# EAGLE design Me-Base Shield v2.0 (EAGLE 6.2)
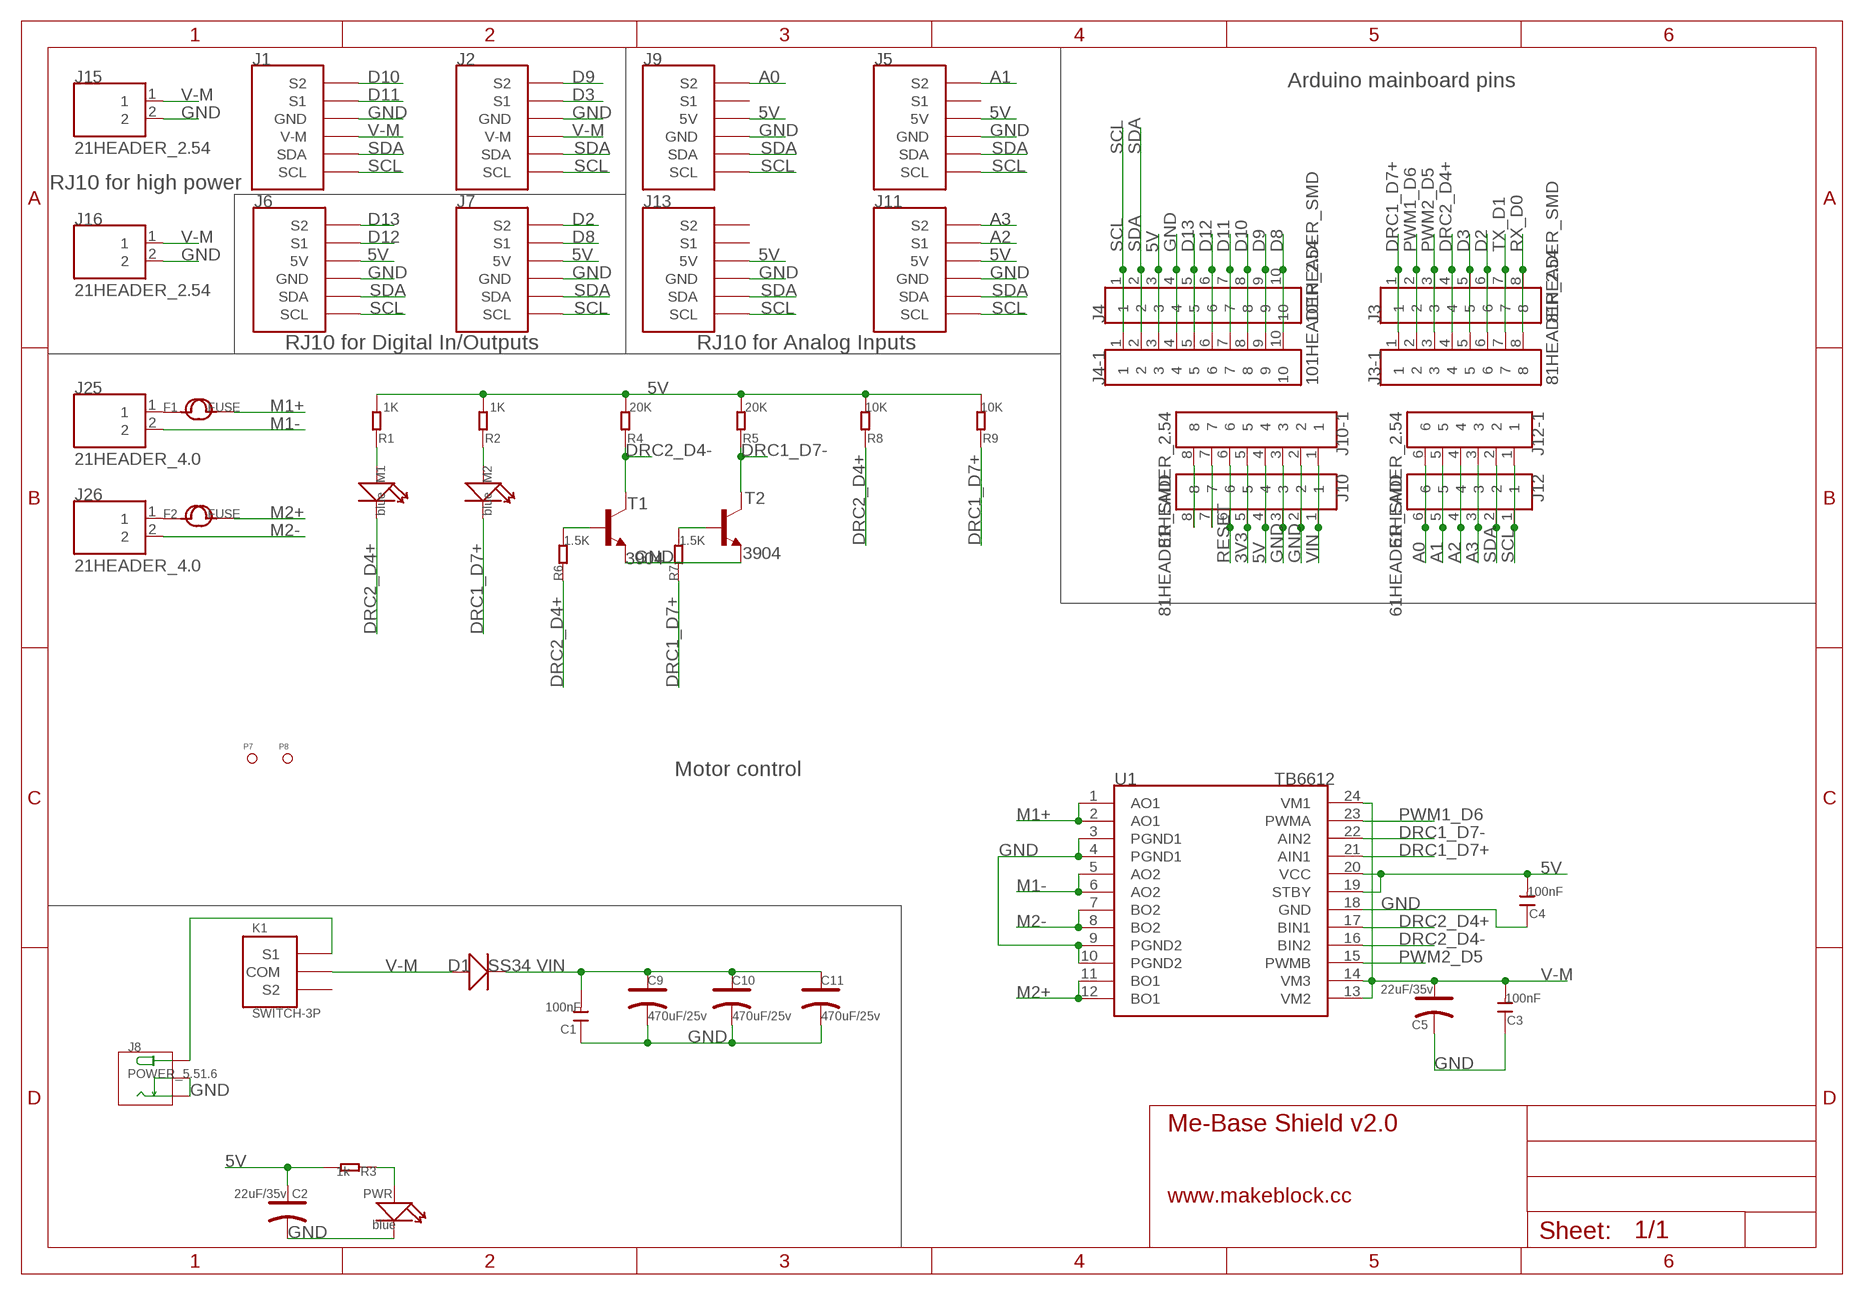
[diagram p0: schematic, sheet 1]

## Parts
C1  100nF  C-0603  [0603]
C2  22uF/35v  CAP-ELECTRO-B  [ELECTRO-SMD-B-4.8MM]
C3  100nF  C-0603  [0603]
C4  100nF  C-0603  [0603]
C5  22uF/35v  CAP-ELECTRO-B  [ELECTRO-SMD-B-4.8MM]
C9  470uF/25v  CAP-ELECTRO-E  [ELECTRO-SMD-E-7.8MM]
C10  470uF/25v  CAP-ELECTRO-E  [ELECTRO-SMD-E-7.8MM]
C11  470uF/25v  CAP-ELECTRO-E  [ELECTRO-SMD-E-7.8MM]
D1  SS34  D'SMA'  [D2010]
F1  FUSE  [FUSE]
F2  FUSE  [FUSE]
J1  RJ11-6P6C-MOTOR  [RJ11-6P6C]
J2  RJ11-6P6C-MOTOR  [RJ11-6P6C]
J3  81HEADER_SMD  [8*1HEADER_SMD]
J3-1  81HEADER_2.54  [8*1HEADER_2.54]
J4  101HEADER_SMD  [10*1HEADER_SMD]
J4-1  101HEADER_2.54  [10*1HEADER_2.54]
J5  RJ11-6P6C-DIGI  [RJ11-6P6C]
J6  RJ11-6P6C-DIGI  [RJ11-6P6C]
J7  RJ11-6P6C-DIGI  [RJ11-6P6C]
J8  POWER_5.51.6  [POWER_5.5*1.6]
J9  RJ11-6P6C-DIGI  [RJ11-6P6C]
J10  81HEADER_SMD  [8*1HEADER_SMD]
J10-1  81HEADER_2.54  [8*1HEADER_2.54]
J11  RJ11-6P6C-DIGI  [RJ11-6P6C]
J12  61HEADER_SMD  [6*1HEADER_SMD]
J12-1  61HEADER_2.54  [6*1HEADER_2.54]
J13  RJ11-6P6C-DIGI  [RJ11-6P6C]
J15  21HEADER_2.54  [2*1HEADER_2.54]
J16  21HEADER_2.54  [2*1HEADER_2.54]
J25  21HEADER_4.0  [2*1HEADER_4.0]
J26  21HEADER_4.0  [2*1HEADER_4.0]
K1  SWITCH-3P  [SWITCH_3P]
M1  blue  LED'0603'  [LED-0603]
M2  blue  LED'0603'  [LED-0603]
P7  PAD-MARK  [ROUND-MARK-1.0]
P8  PAD-MARK  [ROUND-MARK-1.0]
PWR  blue  LED'0603'  [LED-0603]
R1  1K  R-0603  [0603]
R2  1K  R-0603  [0603]
R3  1k  R-0603  [0603]
R4  20K  R-0603  [0603]
R5  20K  R-0603  [0603]
R6  1.5K  R-0603  [0603]
R7  1.5K  R-0603  [0603]
R8  10K  R-0603  [0603]
R9  10K  R-0603  [0603]
T1  3904  [3904]
T2  3904  [3904]
U1  TB6612  [TB6612FNG]

## Nets
3V3: J10-1.5 J10.5
5V: C2.+ C4.2 J4-1.3 J4.3 J5.4(5V) J6.4(5V) J7.4(5V) J9.4(5V) J10-1.4 J10.4 J11.4(5V) J13.4(5V) R1.2 R2.2 R3.2 R4.2 R5.2 R8.2 R9.2 U1.19(STBY) U1.20(VCC)
A0: J9.6(S2) J12-1.6 J12.6
A1: J5.6(S2) J12-1.5 J12.5
A2: J11.5(S1) J12-1.4 J12.4
A3: J11.6(S2) J12-1.3 J12.3
D2: J3-1.6 J3.6 J7.6(S2)
D3: J2.5(S1) J3-1.5 J3.5
D8: J4-1.10 J4.10 J7.5(S1)
D9: J2.6(S2) J4-1.9 J4.9
D10: J1.6(S2) J4-1.8 J4.8
D11: J1.5(S1) J4-1.7 J4.7
D12: J4-1.6 J4.6 J6.5(S1)
D13: J4-1.5 J4.5 J6.6(S2)
DRC1_D7+: J3-1.1 J3.1 M2.- R7.1 R9.1 U1.21(AIN1)
DRC1_D7-: R5.1 T2.3(C) U1.22(AIN2)
DRC2_D4+: J3-1.4 J3.4 M1.- R6.1 R8.1 U1.17(BIN1)
DRC2_D4-: R4.1 T1.3(C) U1.16(BIN2)
GND: C1.1 C2.- C3.1 C4.1 C5.- C9.- C10.- C11.- J1.4(GND) J2.4(GND) J4-1.4 J4.4 J5.3(GND) J6.3(GND) J7.3(GND) J8.1(-) J8.2(-) J8.3(-) J8.4(-) J8.5(-) J8.6(-) J8.7(-) J8.8(-) J8.9(-) J8.10(-) J8.11(-) J8.12(-) J8.13(CDN) J8.14(CDN) J8.15(CDN) J8.16(CDN) J8.17(CDN) J8.18(CDN) J8.19(CDN) J8.20(CDN) J8.21(CDN) J8.22(CDN) J8.23(CDN) J8.24(CDN) J8.- J8.CDN J9.3(GND) J10-1.2 J10-1.3 J10.2 J10.3 J11.3(GND) J13.3(GND) J15.2 J16.2 PWR.- T1.2(E) T2.2(E) U1.3(PGND1) U1.4(PGND1) U1.9(PGND2) U1.10(PGND2) U1.18(GND)
M1+: F1.2 U1.1(AO1) U1.2(AO1)
M1-: J25.2 U1.5(AO2) U1.6(AO2)
M2+: F2.2 U1.11(BO1) U1.12(BO1)
M2-: J26.2 U1.7(BO2) U1.8(BO2)
N$1: J10-1.7 J10.7
N$2: J10-1.8 J10.8
N$3: M1.+ R1.1
N$4: M2.+ R2.1
N$5: PWR.+ R3.1
N$6: F1.1 J25.1
N$7: J8.25(+) J8.26(+) J8.27(+) J8.28(+) J8.29(+) J8.30(+) J8.31(+) J8.32(+) J8.33(+) J8.34(+) J8.35(+) J8.36(+) J8.+ K1.1(S1) K1.P$6(S1) K1.P$16(S1) K1.P$17(S1) K1.P$18(S1) K1.P$20(S1) K1.P$21(S1)
N$8: F2.1 J26.1
N$22: R6.2 T1.1(B)
N$23: R7.2 T2.1(B)
PWM1_D6: J3-1.2 J3.2 U1.23(PWMA)
PWM2_D5: J3-1.3 J3.3 U1.15(PWMB)
RESET: J10-1.6 J10.6
RX_D0: J3-1.8 J3.8
SCL: J1.1(SCL) J2.1(SCL) J4-1.1 J4.1 J5.1(SCL) J6.1(SCL) J7.1(SCL) J9.1(SCL) J11.1(SCL) J12-1.1 J12.1 J13.1(SCL)
SDA: J1.2(SDA) J2.2(SDA) J4-1.2 J4.2 J5.2(SDA) J6.2(SDA) J7.2(SDA) J9.2(SDA) J11.2(SDA) J12-1.2 J12.2 J13.2(SDA)
TX_D1: J3-1.7 J3.7
V-M: C3.2 C5.+ D1.+ J1.3(V-M) J2.3(V-M) J15.1 J16.1 K1.2(COM) K1.P$1(COM) K1.P$2(COM) K1.P$3(COM) K1.P$4(COM) K1.P$5(COM) K1.P$7(COM) U1.13(VM2) U1.14(VM3) U1.24(VM1)
VIN: C1.2 C9.+ C10.+ C11.+ D1.- J10-1.1 J10.1
Unconnected: J5.5(S1) J9.5(S1) J13.5(S1) J13.6(S2) K1.3(S2) K1.P$8(S2) K1.P$9(S2) K1.P$11(S2) K1.P$12(S2) K1.P$13(S2) K1.P$14(S2)

## Notes on the sheet
- Arduino mainboard pins
- RJ10 for high power
- RJ10 for Digital In/Outputs | RJ10 for Analog Inputs
- Motor control
- www.makeblock.cc

## Library data of the parts
C1 C3 C4 = Discrete:C*: Ceramic Capacitors
C2 C5 C9-C11 = Discrete:CAP*: Electrolytic Capacitors,Tantalum Capacitors and Super Capacitors
D1 = Discrete:D*
F1 F2 = Makeblock:FUSE
J1 J2 = Makeblock:RJ11-6P6C-MOTOR
J3 J10 = Me-Base Shield:8*1HEADER_SMD: 8x1HEADER_SMD
J3-1 J10-1 = Me-Base Shield:8*1HEADER_2.54: 8x1HEADER_2.54
J4 = Me-Base Shield:10*1HEADER_SMD: 10x1HEADER_SMD
J4-1 = Me-Base Shield:10*1HEADER_2.54: 10x1HEADER_2.54
J5-J7 J9 J11 J13 = Makeblock:RJ11-6P6C-DIGI
J8 = Makeblock:POWER_5.5*1.6
J12 = Me-Base Shield:6*1HEADER_SMD: 6x1HEADER_SMD
J12-1 = Me-Base Shield:6*1HEADER_2.54: 6x1HEADER_2.54
J15 J16 = Me-Base Shield:2*1HEADER_2.54
J25 J26 = Makeblock:2*1HEADER_4.0
K1 = Makeblock:SWITCH-3P
M1 M2 PWR = Discrete:LED*
P7 P8 = Discrete:PAD-MARK; PARTNO: DNP
R1-R9 = Discrete:R*
T1 T2 = Makeblock:3904
U1 = Me-Base Shield:TB6612: TB6612

## Board
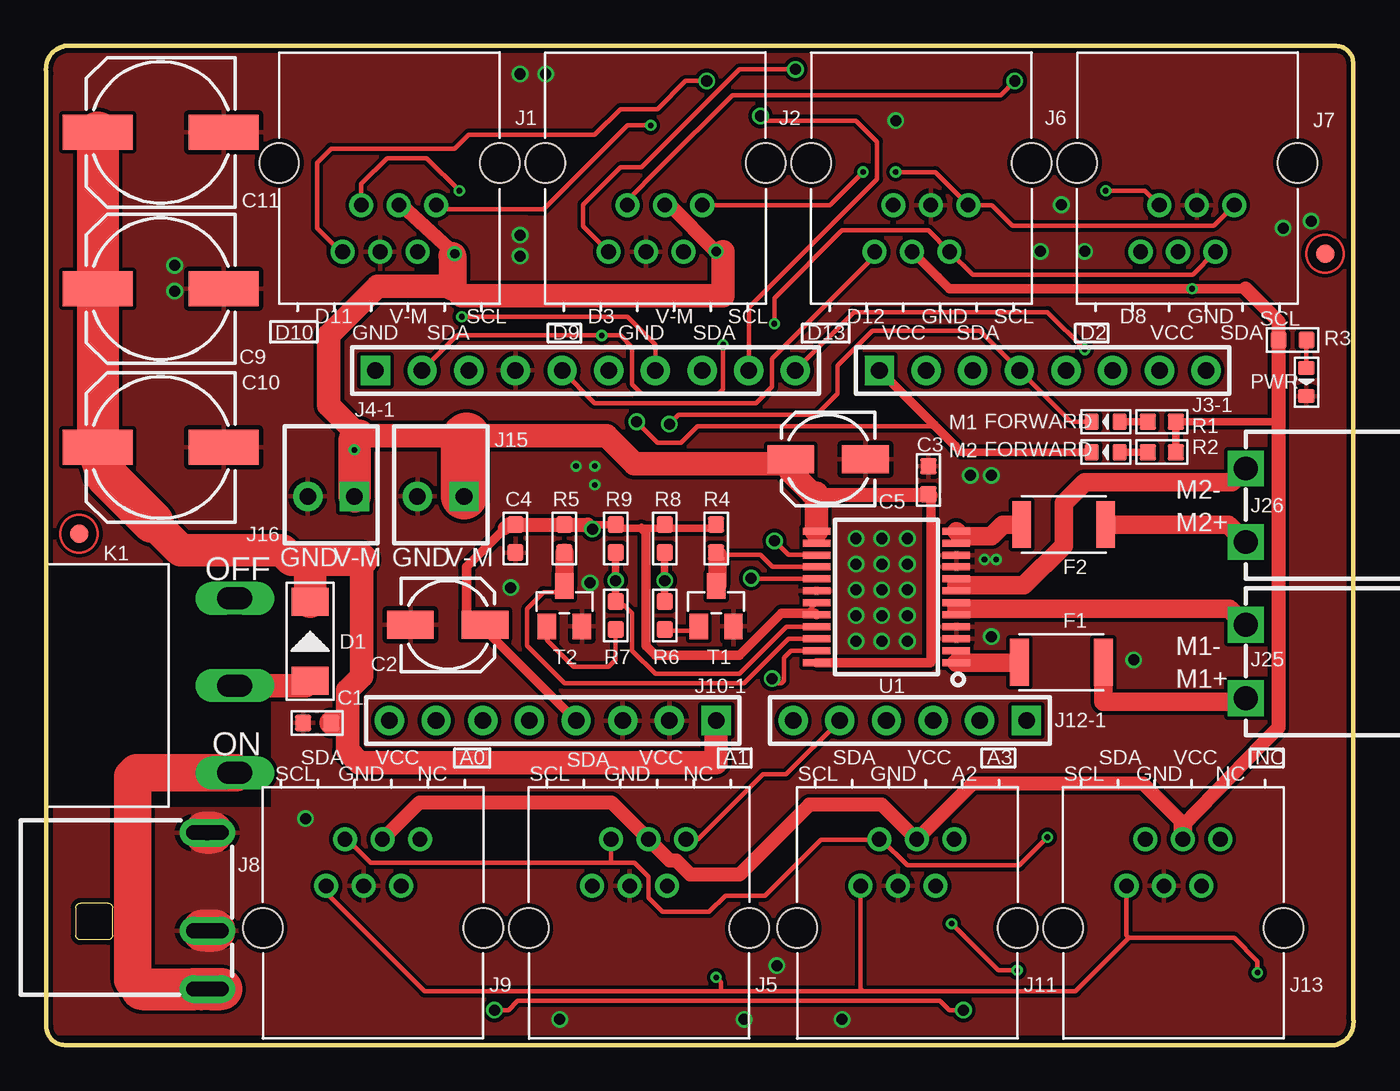
[diagram p1: board, top side]
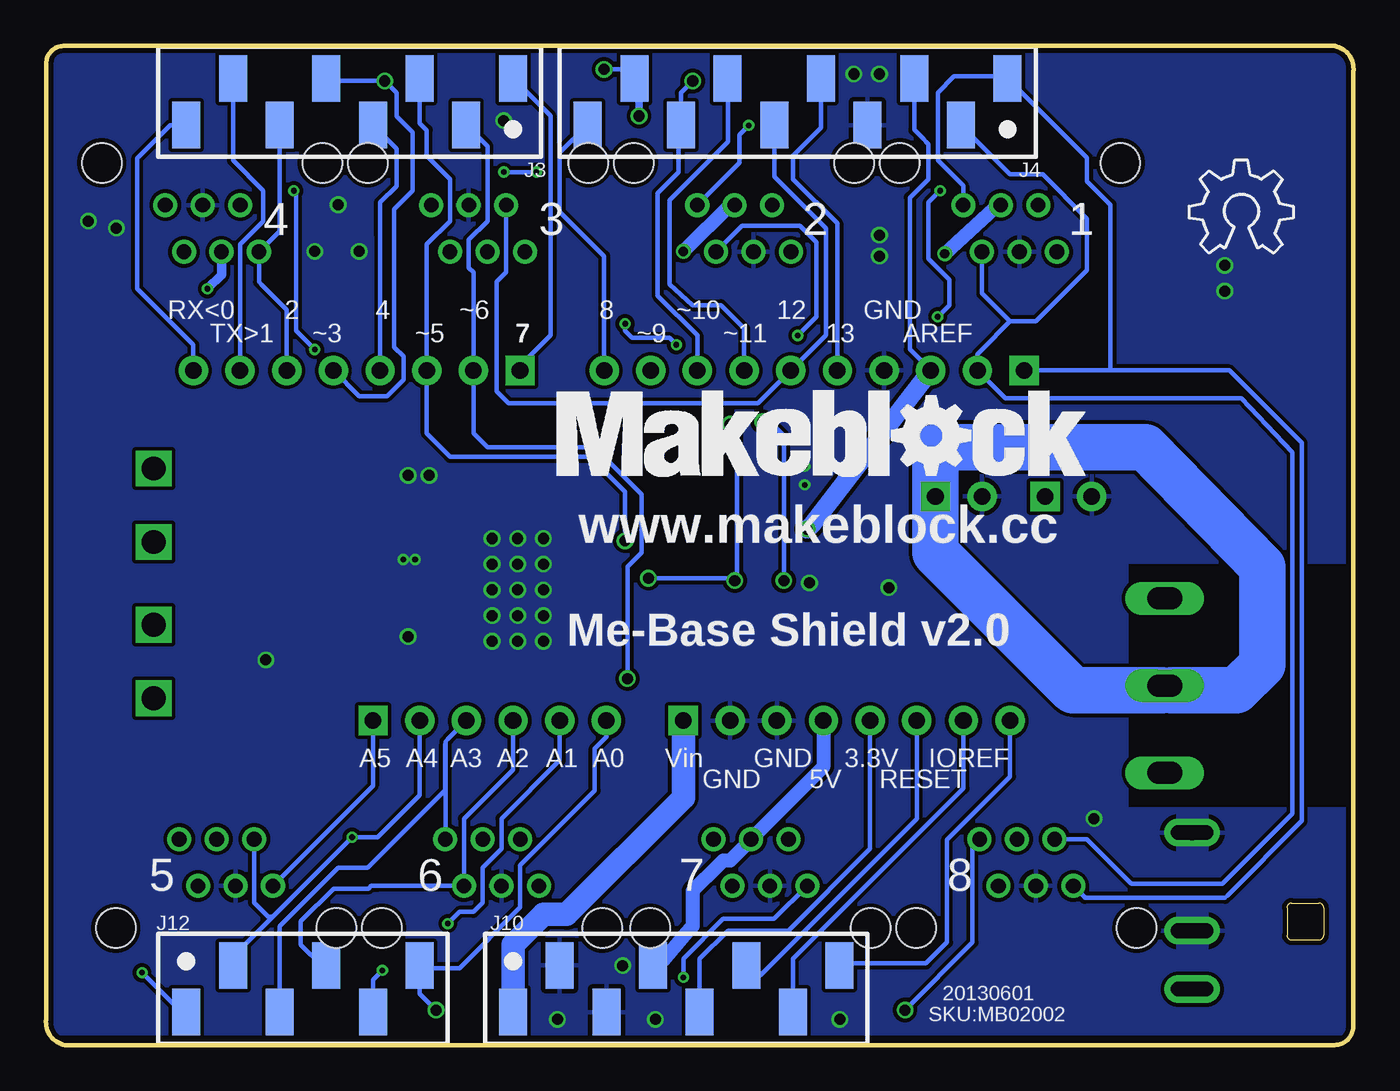
[diagram p2: board, bottom side, seen from below]

Size 71.17 x 54.36 mm. Coordinates in mm from the lower left corner, seen from the top.
Outline: 71.15,1.52 71.15,53.48 arc90 70.15,54.36
Outline: 70.13,54.36 1.03,54.36 arc90 0.03,52.85 0.03,1 arc90 1.03,0 70.15,0 arc90 71.15,1.51
Copper layers (1*16): Top 0.035mm / dielectric 1.5mm / Bottom 0.035mm
Design rules: minimum track width 6mil, minimum drill 12mil, track to track 8mil, track to pad 8mil, pad to pad 8mil, via to via 8mil, smd to smd 0mil, copper to edge 10mil, drill to drill 10mil, minimum pad ring 10mil, minimum via ring 6mil, stop-mask expansion 2mil, vias tented up to drill 100mil, thermal gap 10mil

### Footprints (pad centres in the part's own frame; a part is rotated, then mirrored left to right if it is on the bottom)
0603 = smd 0.889 x 0.889: 1 -0.762,0; 2 0.762,0
ELECTRO-SMD-B-4.8MM = smd 2.54 x 1.524: + 2.032,0; - -2.032,0
ELECTRO-SMD-E-7.8MM = smd 3.81 x 1.905: + 3.429,0; - -3.429,0
D2010 = smd 1.524 x 2.032: + -2.159,0; - 2.159,0
FUSE = smd 1.016 x 2.54: 1 -2.286,0; 2 2.286,0
RJ11-6P6C = drill 0.8: 1 -2.55,1.8; 2 -1.53,4.34; 3 -0.51,1.8; 4 0.51,4.34; 5 1.53,1.8; 6 2.55,4.34 | hole 2.15: -6,-0.5; 6,-0.5
8*1HEADER_SMD = smd 2.54 x 1.524: 1 0,0; 2 2.54,-2.54; 3 0,-5.08; 4 2.54,-7.62; 5 0,-10.16; 6 2.54,-12.7; 7 0,-15.24; 8 2.54,-17.78
8*1HEADER_2.54 = drill 0.9 pad 1.6 square: 1 0,0 | drill 0.9 pad 1.6: 2 0,-2.54; 3 0,-5.08; 4 0,-7.62; 5 0,-10.16; 6 0,-12.7; 7 0,-15.24; 8 0,-17.78
10*1HEADER_SMD = smd 2.54 x 1.524: 1 0,0; 2 2.54,-2.54; 3 0,-5.08; 4 2.54,-7.62; 5 0,-10.16; 6 2.54,-12.7; 7 0,-15.24; 8 2.54,-17.78; 9 0,-20.32; 10 2.54,-22.86
10*1HEADER_2.54 = drill 0.9 pad 1.6 square: 1 0,0 | drill 0.9 pad 1.6: 2 0,-2.54; 3 0,-5.08; 4 0,-7.62; 5 0,-10.16; 6 0,-12.7; 7 0,-15.24; 8 0,-17.78; 9 0,-20.32; 10 0,-22.86
POWER_5.5*1.6 = drill 0.8: 1 -5.334,9.398; 2 -5.334,9.525; 3 -5.334,9.652; 4 -5.334,9.779; 5 -5.334,9.906; 6 -5.334,10.033; 7 -5.334,10.287; 8 -5.334,10.414; 9 -5.334,10.541; 10 -5.334,10.668; 11 -5.334,10.795; 12 -5.334,10.922; 13 0,9.398; 14 0,9.525; 15 0,9.652; 16 0,9.779; 17 0,9.906; 18 0,10.033; 19 0,10.287; 20 0,10.414; 21 0,10.541; 22 0,10.668; 23 0,10.795; 24 0,10.922; 25 3.175,9.398; 26 3.175,9.525; 27 3.175,9.652; 28 3.175,9.779; 29 3.175,9.906; 30 3.175,10.033; 31 3.175,10.287; 32 3.175,10.414; 33 3.175,10.541; 34 3.175,10.668; 35 3.175,10.795; 36 3.175,10.922 | drill 0.813 pad 1.524 long: + 3.175,10.16; - -5.334,10.16; CDN 0,10.16
6*1HEADER_SMD = smd 2.54 x 1.524: 1 0,0; 2 2.54,-2.54; 3 0,-5.08; 4 2.54,-7.62; 5 0,-10.16; 6 2.54,-12.7
6*1HEADER_2.54 = drill 0.9 pad 1.6 square: 1 0,0 | drill 0.9 pad 1.6: 2 0,-2.54; 3 0,-5.08; 4 0,-7.62; 5 0,-10.16; 6 0,-12.7
2*1HEADER_2.54 = drill 0.9 pad 1.6 square: 1 0,-2.54 | drill 0.9 pad 1.6: 2 0,0
2*1HEADER_4.0 = drill 1.3 pad 1.95 square: 1 0,-4; 2 0,0
SWITCH_3P = drill 1.2 long: 1 -4.75,-4.26; 2 0,-4.16; 3 4.75,-4.46; P$1 0,-4.76; P$2 0,-4.56; P$3 0,-4.46; P$4 0,-4.36; P$5 0,-4.26; P$6 -4.75,-4.76; P$7 0,-4.06; P$8 4.75,-4.76; P$9 4.75,-4.56; P$11 4.75,-4.36; P$12 4.75,-4.26; P$13 4.75,-4.16; P$14 4.75,-4.06; P$16 -4.75,-4.56; P$17 -4.75,-4.46; P$18 -4.75,-4.36; P$20 -4.75,-4.16; P$21 -4.75,-4.06
LED-0603 = smd 0.762 x 0.889: + -0.762,0; - 0.762,0
ROUND-MARK-1.0 = smd 1.016 x 1.016: P$1 0,0
3904 = smd 1 x 1.4: 1 -0.95,-1.1; 2 0.95,-1.1; 3 0,1.1
TB6612FNG = smd 1.5 x 0.381: 1 -3.8,3.575; 2 -3.8,2.925; 3 -3.8,2.275; 4 -3.8,1.625; 5 -3.8,0.975; 6 -3.8,0.325; 7 -3.8,-0.325; 8 -3.8,-0.975; 9 -3.8,-1.625; 10 -3.8,-2.275; 11 -3.8,-2.925; 12 -3.8,-3.575; 13 3.8,-3.575; 14 3.8,-2.925; 15 3.8,-2.275; 16 3.8,-1.625; 17 3.8,-0.975; 18 3.8,-0.325; 19 3.8,0.325; 20 3.8,0.975; 21 3.8,1.625; 22 3.8,2.275; 23 3.8,2.925; 24 3.8,3.575

### Placement (x,y rotation side)
C1  14.76,17.53 0 top
C2  21.87,22.86 0 top
C3  48.03,30.73 270 top
C4  25.55,27.56 90 top
C5  42.57,31.88 180 top
C9  6.25,41.15 180 top
C10  6.25,32.51 180 top
C11  6.25,49.66 180 top
D1  14.38,21.97 90 top
F1  55.27,20.83 180 top
F2  55.4,28.32 180 top
J1  18.69,47.5 180 top
J2  33.17,47.5 180 top
J3  45.75,52.59 270 bottom
J3-1  45.36,36.7 90 top
J4  18.83,52.59 270 bottom
J4-1  17.93,36.7 90 top
J5  32.28,6.86 0 top
J6  47.65,47.5 180 top
J7  62.13,47.5 180 top
J8  -1.37,6.22 270 top
J9  17.81,6.86 0 top
J10  45.75,1.79 90 bottom
J10-1  36.47,17.65 270 top
J11  46.89,6.86 0 top
J12  63.53,1.79 90 bottom
J12-1  53.37,17.65 270 top
J13  61.37,6.86 0 top
J15  20.22,29.84 90 top
J16  14.25,29.84 90 top
J25  65.3,22.86 0 top
J26  65.3,31.37 0 top
K1  5.87,19.56 90 top
M1  57.68,33.91 180 top
M2  57.68,32.26 180 top
P7  1.8,27.81 0 top
P8  69.62,43.05 0 top
PWR  68.61,36.07 270 top
R1  60.73,33.91 0 top
R2  60.73,32.26 0 top
R3  67.84,38.35 180 top
R4  36.47,27.56 90 top
R5  28.22,27.56 90 top
R6  33.68,23.37 270 top
R7  31.01,23.37 270 top
R8  33.68,27.56 90 top
R9  31.01,27.56 90 top
T1  36.47,23.88 0 top
T2  28.22,23.88 0 top
U1  45.75,24.38 180 top
U$2  [OSHW_6X200_NOTEXT]  8.95,43.08 0 bottom

### Tracks (layer width: path | path; a pad name or v marks a point on that pad's centre or on a via)
3V3
  Bottom 0.254: J10-1.5 26.31,10.67 30.76,6.22 34.06,6.22 35.59,4.69 J10.5
  Bottom 0.406: J10.5
5V  (via drill 0.3 pad 0.61, 0.6)
  Top 0.254: 41.38,23.5 U1.19 | 23.96,22.48 23.96,22.54 | C2.+ 23.9,22.61 | 66.2,16.38 66.19,16.39 | 66.96,33.91 67.08,33.91 | J13.4 61.88,11.05 | J6.4 47.14,43.18
  Top 0.406: 33.81,28.13 32.41,28.13 31.01,28.13 R9.2 30,28.32 v29.74,28.07 | 33.81,28.13 36.47,28.13 R4.2 | R8.2 33.81,28.32 33.81,28.13 | R2.2 R1.2 66.96,33.91
  Top 0.508: 32.41,28.13 32.66,27.88 32.66,21.72 33.17,21.21 37.74,21.21 40.03,23.5 41.38,23.5 41.86,23.5 U1.20 | 24.98,28.13 22.89,26.04 22.89,22.61 23.9,22.61 23.96,22.54 J10-1.4 | 29.68,28.13 v29.74,28.07 29.81,28.13 | 47.14,43.18 48.54,41.78 49.17,41.15 v62.38,41.15 65.3,41.15
  Top 0.762: v29.74,28.07 29.49,28.32 R5.2 C4.2 25.17,28.32 24.98,28.13 | 61.87,11.94 66.19,16.39 67.08,17.27 67.08,33.91 R3.2 67.08,39.37 65.3,41.15 | J9.4 18.34,11.2 20.35,13.21 30.78,13.21 J5.4 33.96,10.03 34.32,10.03 35.08,9.27 37.74,9.27 41.55,13.08 45.49,13.08 47.37,11.2 J11.4 50.42,14.22 59.72,14.22 61.87,12.06 61.87,11.05
  Top 1.016: J13.4 61.88,11.05 61.87,11.05 61.87,11.94
  Bottom 0.254: 23.8,52.7 J4.3 23.91,49.79 23.39,49.28 23.27,49.15 23.14,49.02 23.14,47.12 24.16,46.1 24.16,37.85 J4-1.3
  Bottom 0.508: v62.38,41.15 61.62,41.91 J7.4
  Bottom 0.762: J10-1.4 28.85,15.14 J5.4 32.79,11.17 33.93,10.03 34.32,10.03 34.57,9.78 35.97,8.38 35.97,6.48 37.62,4.57 37.89,4.57 J10.4
  Bottom 1.016: J4-1.3 29.49,28.32 v29.74,28.07
A0  (via drill 0.6)
  Top 0.254: v24.41,1.91 25.17,1.91 25.68,2.41 48.67,2.41 49.17,1.91 v49.94,1.91
  Bottom 0.254: 50.69,4.19 48.67,4.19 45.36,7.49 45.36,9.78 41.3,13.84 41.3,16.13 40.67,16.76 J12-1.6 | v24.41,1.91 20.73,5.58 20.73,10.95 20.61,10.95 J9.6 | v49.94,1.91 50.83,2.8 J12.6
  Bottom 0.406: 50.69,4.19 J12.6
A1  (via drill 0.3 pad 0.61)
  Top 0.254: J12-1.5 40.28,14.73 39.01,14.73 35.48,11.2 J5.6 | v49.3,6.6 51.84,4.06 v52.86,4.06
  Bottom 0.254: J12-1.5 43.21,15.49 46.38,12.32 46.38,10.67 47.4,9.65 47.4,7.75 47.9,7.24 48.67,7.24 v49.3,6.6 | v52.86,4.06 53.37,3.55 J12.5
  Bottom 0.406: J12.5
A2
  Bottom 0.254: 55.91,5.46 J12.4 56.17,4.33 57.3,5.46 57.3,6.73 55.52,8.51 53.62,8.51 53.47,8.66 53.13,8.66 J11.5 48.41,12.32 45.75,14.99 45.75,16.38 J12-1.4
A3
  Bottom 0.254: J12.3 58.45,6.47 55.27,9.65 53.65,9.65 49.44,13.87 49.44,16.37 49.43,16.38 | J12-1.3 49.3,16.64 49.43,16.51 49.43,16.38 | 49.43,16.38 J11.6
D2
  Bottom 0.254: 59.58,41.52 59.46,41.4 | 59.46,41.4 58.06,40.01 J3-1.6 | 58.45,49.4 58.45,44.28 J7.6 59.58,41.52 | 59.58,41.52 59.46,41.4
  Bottom 0.406: 58.7,49.8 J3.6 58.45,49.4
D3  (via drill 0.6)
  Top 0.254: v52.73,52.45 51.97,51.69 37.36,51.69 33.42,47.75 31.65,45.96 J2.5
  Bottom 0.254: 55.27,52.45 v52.73,52.45 52.1,51.82 52.1,50.55 51.21,49.66 51.21,46.48 51.84,45.85 52.22,45.47 52.22,37.97 51.71,37.47 51.71,36.2 52.6,35.31 54.13,35.31 J3-1.5
  Bottom 0.406: 56.16,52.34 J3.5 55.41,52.59 55.27,52.45
D8  (via drill 0.3 pad 0.61)
  Top 0.254: J4-1.10 43.97,39.88 54.51,39.88 v56.54,37.85 | v57.68,46.48 59.81,46.48 J7.5
  Bottom 0.254: J4.10 43.21,48.53 43.21,45.34 40.79,42.93 J4-1.10 | v56.54,37.85 57.56,38.86 57.56,46.35 v57.68,46.48
D9  (via drill 0.6)
  Top 0.254: J4-1.9 38.25,40.13 45.24,47.12 45.24,49.15 44.09,50.29 39.14,50.29 v38.89,50.55 | v40.79,53.09 37.74,53.09 32.4,47.75 31.26,47.75 29.24,45.72 29.24,44.55 J2.6
  Bottom 0.254: v40.79,53.09 39.64,53.09 J4.9
  Bottom 0.406: J4.9 38.89,52.33 v38.89,50.55
D10  (via drill 0.6)
  Top 0.254: v35.97,52.45 34.82,52.45 33.3,50.93 31.27,50.93 29.87,49.53 23.01,49.53 22.25,48.77 15.52,48.77 14.76,48.01 14.76,44.45 16.05,43.16 J1.6
  Bottom 0.254: 36.73,49.93 36.73,47.5 37.87,46.35 37.87,40.77 35.71,38.61 J4-1.8 | v35.97,52.45 36.61,51.81 J4.8
  Bottom 0.406: J4.8 36.73,49.93
D11  (via drill 0.3 pad 0.61)
  Top 0.254: v22.63,39.62 31.65,39.62 33.17,38.1 J4-1.7 | v22.5,46.48 20.73,48.26 18.57,48.26 17.16,46.86 J1.5
  Bottom 0.254: J4.7 34.06,49.15 37.24,45.97 37.24,41.4 35.97,40.26 34.44,40.26 33.17,38.99 J4-1.7 | v22.63,39.62 22,40.26 22,41.63 23.14,42.77 23.14,43.94 23.14,44.83 23.14,45.72 23.14,45.85 v22.5,46.48
  Bottom 0.406: J4.7
D12
  Bottom 0.254: J4.6 31.52,47.24 28.73,44.45 28.73,38.61 J4-1.6 32.41,34.92 46,34.92 46.63,35.56 46.63,41.53 46.13,42.04 J6.5
  Bottom 0.406: J4.6
D13
  Top 0.254: J4-1.5 29.87,34.92 38.63,34.92 39.52,35.81 39.52,37.34 45.09,42.9 45.09,43.15 J6.6
  Bottom 0.254: J4.5 28.98,49.91 30.51,48.39 30.51,47.12 28.09,44.7 J4-1.5
  Bottom 0.406: J4.5
DRC1_D7+  (via drill 0.6)
  Top 0.254: 41.97,22.73 U1.21 40.31,22.76 37.74,20.19 33.17,20.19 31.9,21.46 31.9,23.5 31.46,23.94 31.01,23.94 R7.1 | 48.35,33.72 48.29,33.66 35.46,33.66 34.57,32.77 33.3,32.77 v32.16,33.91
  Top 0.406: R9.1 v31.01,25.27 R7.1 | M2.- 49.81,32.26 49.49,32.58
  Top 0.508: J3-1.1 48.35,33.72 49.49,32.58
  Bottom 0.254: J3.1 43.71,50.55 43.71,38.61 45.36,36.96 J3-1.1 | v32.16,33.91 31.78,33.91 31.01,33.15 v31.01,25.27
DRC1_D7-
  Top 0.254: U1.22 40.42,22.11 38,19.68 28.22,19.68 26.19,21.72 26.19,23.75 27.08,24.64 28.18,24.64 28.18,24.98 T2.3
  Top 1.016: R5.1 T2.3
DRC2_D4+  (via drill 0.6)
  Top 0.254: U1.17 38.8,25.36 v38.38,25.4 | v33.93,33.78 34.44,34.29 41.94,34.29 43.08,35.43 43.08,36.96 44.98,38.86 50.83,38.86 J3-1.4 55.78,33.91 M1.-
  Top 0.406: R8.1 v33.68,25.27 R6.1
  Bottom 0.254: J3-1.4 52.98,44.07 52.98,45.85 52.1,46.74 52.1,48.78 J3.4 | v38.38,25.4 33.81,25.4 v33.68,25.27 33.55,25.4 33.55,33.4 v33.93,33.78
  Bottom 0.406: J3.4 53.39,50.04
DRC2_D4-
  Top 0.254: U1.16 39.55,26.01 38.89,26.67 36.54,26.67 36.54,26.8 R4.1
  Top 1.016: 36.54,26.67 36.54,25.04 T1.3
GND  (via drill 0.3 pad 0.61, 0.6)
  Top 2.286: J8.18 J8.19 | J8.19 J8.21 | J8.19 J8.17 | J8.7 J8.6 J8.8
  other vias: 7.01,42.42 7.01,41.02 25.3,24.89 29.62,25.15 27.97,1.4 38,1.4 43.33,1.4 25.81,52.83 27.2,52.83 44.09,27.56 45.49,27.56 46.89,27.56 44.09,26.16 45.49,26.16 46.89,26.16 44.09,24.77 45.49,24.77 46.89,24.77 44.09,23.37 45.49,23.37 46.89,23.37 44.09,21.97 45.49,21.97 46.89,21.97 29.87,30.48 28.85,31.5 29.87,31.5 14.12,12.32 51.08,26.42 51.71,26.42 51.46,22.23 59.21,20.95 39.78,4.32 25.81,44.07 25.81,42.93 50.32,30.99 51.46,30.99 56.54,43.18 54.13,43.18 67.34,44.45 68.86,44.83 46.25,50.29 55.27,45.72
  pour Bottom: 0.03,53.85 71.15,53.85 71.15,0.64 0.03,0.64
  pour Top: 0.03,53.85 71.15,53.85 71.15,0.64 0.03,0.64
M1+
  Top 0.254: U1.1 U1.2 | 53.11,20.81 53,20.81 F1.2
  Top 1.016: U1.1 53,20.81
M1-
  Top 0.254: U1.6 U1.5 49.55,23.74 49.56,23.75
  Top 1.016: 49.56,23.75 64.41,23.75 J25.2
M2+
  Top 0.254: U1.11 U1.12 49.55,27.7 49.56,27.69
  Top 1.016: F2.2 52.1,28.32 51.46,27.69 49.82,27.69 U1.12
M2-
  Top 0.254: U1.8 U1.7 49.55,25.01 49.56,25.02
  Top 1.016: 49.56,25.02 53.24,25.02 55.4,27.18 55.4,29.46 56.54,30.61 64.54,30.61 J26.2
N$1
  Bottom 0.254: J10.7 30.51,4.7 21.23,13.97 J10-1.7
  Bottom 0.406: J10.7
N$2
  Bottom 0.254: 27.86,4.45 23.27,4.45 22.12,5.59 22.12,11.18 18.69,14.61 J10-1.8
  Bottom 0.406: J10.8 27.86,4.45
N$3
  Top 0.406: M1.+ R1.1
N$4
  Top 0.406: M2.+ R2.1
N$5
  Top 0.254: R3.1 PWR.+
N$6
  Top 1.016: F1.1 57.56,18.67 65.11,18.67 J25.1
N$7
  Top 1.27: K1.P$6 K1.P$16 K1.P$17
  Top 2.032: 5.23,3.05 4.72,3.56 4.72,14.61 4.93,14.81 K1.P$21 K1.P$20 K1.1 K1.P$18 K1.P$17
  Top 2.286: 5.23,3.05 J8.25 J8.26 J8.27 J8.28 J8.29 J8.30 | J8.32 J8.31 J8.+ J8.30 | J8.32 J8.33 J8.34 J8.35 J8.36 | J8.32 J8.30
N$8
  Top 1.016: F2.1 64.35,28.32 J26.1
N$22
  Top 0.254: 35.5,22.78 35.5,22.54 | 35.5,22.54 33.74,22.54 R6.2 | T1.1 35.52,22.56 35.5,22.54
N$23
  Top 0.254: R7.2 31.01,20.95 30.63,20.57 28.73,20.57 27.27,22.03 T2.1
PWM1_D6  (via drill 0.6)
  Top 0.254: v39.52,19.94 39.52,19.81 39.65,19.68 40.03,19.68 40.16,19.81 40.16,21.08 40.54,21.46 U1.23
  Bottom 0.254: v39.52,19.94 39.52,26.04 38.76,26.8 38.76,29.97 41.3,32.51 47.14,32.51 47.9,33.27 J3-1.2 47.9,42.04 48.16,42.29 48.16,43.81 47.14,44.83 47.14,48.9 J3.2
  Bottom 0.406: J3.2
PWM2_D5  (via drill 0.6)
  Top 0.254: v39.65,27.43 40.41,26.67 41.93,26.67 U1.15
  Bottom 0.254: J3.3 50.83,50.16 50.44,49.78 50.44,48.39 49.17,47.12 49.17,44.83 50.44,43.56 J3-1.3 50.44,33.27 49.17,32 41.55,32 39.65,30.1 v39.65,27.43
  Bottom 0.406: J3.3
RESET
  Bottom 0.254: J10-1.6 23.77,12.32 32.28,3.81 33.05,3.81 33.05,3.82 J10.6 33.04,4.32
RX_D0
  Bottom 0.254: 63.55,50.04 64.41,50.04 66.19,48.26 66.19,41.15 63.14,38.1 J3-1.8
  Bottom 0.406: J3.8 63.55,50.04
SCL  (via drill 0.3 pad 0.61)
  Top 0.254: 36.73,2.92 20.6,2.92 15.38,8.14 15.38,8.53 J9.1 | 36.73,2.92 44.22,2.92 44.35,2.92 | 44.35,2.92 44.48,2.92 | 44.48,2.92 56.03,2.92 58.07,4.96 58.82,5.71 58.95,5.84 | v44.48,47.5 42.68,45.7 J2.1 | v46.25,47.5 48.4,47.5 J6.1 51.48,45.7 52.6,44.58 63.56,44.58 J7.1 | 36.73,2.92 36.73,3.43 v36.47,3.68 36.6,3.56 | 44.34,2.93 44.35,2.92 | v65.94,3.94 65.94,4.57 64.67,5.84 58.95,5.84 | J11.1 44.34,3.06 44.48,2.92 | J13.1 58.82,5.98 58.95,5.84 | J1.1 21.48,45.47 26.31,45.47 27.08,45.47 30.25,48.64 31.65,50.04 v32.92,50.04
  Bottom 0.254: 13.23,36.7 6.76,36.7 2.82,32.77 2.82,12.19 6.87,8.13 7,8 14.63,8 14.63,8.03 J9.1 | 13.23,36.7 13.23,45.72 14.5,46.99 14.5,48.26 14.5,48.27 J4.1 18.94,52.7 21.74,52.7 22.63,51.82 22.63,48.13 21.24,46.75 J1.1 | v44.48,47.5 v46.25,47.5 | v36.47,3.68 36.47,4.7 34.32,6.86 31.66,6.86 31.53,6.86 J5.1 | 13.23,36.7 J4-1.1 | J12-1.1 53.37,14.11 J13.1 | J12.1 63.79,1.79 v65.94,3.94 | v32.92,50.04 33.43,49.53 33.43,47.99 J2.1
SDA  (via drill 0.3 pad 0.61)
  Top 0.254: 49.18,43.19 49.18,43.17 | 49.18,43.17 50.44,41.91 62.41,41.91 J7.2 | 49.18,43.17 48.03,44.32 43.33,44.32 39.65,40.64 v39.65,39.24 | v36.86,38.1 36.86,35.69 36.6,35.43 32.41,35.43 31.9,35.94 31.9,37.97 31.27,38.61 v30.25,38.61 22.38,38.61 J4-1.2 | J9.2 16.39,11.2 17.68,9.91 30.76,9.91 | 30.76,9.91 32.03,9.91 32.79,9.14 32.79,8 33.55,7.24 36.09,7.24 36.98,8.13 39.14,8.13 42.19,11.18 45.21,11.18 45.22,11.18 45.23,11.18 45.49,11.18 46.89,9.78 52.98,9.78 v54.51,11.3 | J5.2 30.75,9.91 30.76,9.91 | 49.18,43.17 J6.2
  Top 0.406: 45.23,11.18 45.36,11.18 J11.2
  Bottom 0.254: 18.69,39.37 20.22,37.84 20.47,37.59 J4-1.2 18.95,35.18 6.12,35.18 3.33,32.26 3.33,12.57 7.14,8.76 12.09,8.76 14.53,11.2 J9.2 | 18.69,39.37 17.3,39.37 14.5,42.16 14.5,44.96 16.92,47.38 18.69,47.38 J4.2 | v30.25,38.61 29.24,39.62 29.24,43.69 30.12,44.58 33.3,44.58 34.7,43.17 J2.2 | v39.65,39.24 39.65,38.86 39.27,38.48 37.24,38.48 v36.86,38.1 | 61.13,4.19 J12.2 | 60.85,4.19 J12.2 | v54.51,11.3 53.11,11.3 50.83,13.59 J12-1.2 | v54.51,11.3 58.83,6.99 | 58.83,6.99 60.99,4.82 J12.2 | 60.99,5.09 J12.2 | v54.51,11.3 58.83,6.99 | 58.83,6.99 59.08,6.99 59.84,7.75 J13.2 | J1.2 20.22,40.9 18.69,39.37
TX_D1
  Bottom 0.254: J3.7 60.99,48.13 59.33,46.48 59.33,44.83 60.6,43.56 J3-1.7
  Bottom 0.406: J3.7
V-M  (via drill 0.3 pad 0.61, 0.51 pad 0.64)
  Top 0.254: U1.14 U1.13 | 41.95,30.03 41.66,30.03 41.66,30.04 | C3.2 48.03,29.91 | 33.93,45.72 v36.47,43.18 | 19.35,45.7 J1.3
  Top 0.508: U1.24 48.14,20.81 48.16,20.83 48.16,29.91
  Top 0.762: 48.16,29.91 48.03,29.91 42.01,29.91 41.95,29.84 | 19.35,45.7 v22.25,43.05 22.12,42.93 | 22.12,41.78 22.63,40.77 | 33.79,45.7 33.93,45.72 v36.48,43.17 36.86,43.17
  Top 1.27: U1.13 41.95,29.84 41.95,30.03 | C5.+ 40.54,31.37 | 40.54,31.37 40.54,31.16 41.66,30.04 | 40.54,31.37 40.28,31.62 32.03,31.62 30.51,33.15 22.89,33.15 17.04,33.15 15.39,34.8 15.39,38.61 18.06,41.27 22.12,41.27 22.63,40.77 36.86,40.77 36.86,43.17 | K1.P$7 14.12,19.56 D1.+
  Top 1.524: 22.12,42.93 22.12,41.27
  Top 1.778: J16.1 v16.79,32.38 16.79,32.89 17.04,33.15
  Top 2.54: J15.1 22.76,33.02 22.89,33.15
  Bottom 0.254: J2.3 33.79,45.7 33.87,45.78
  Bottom 0.762: 19.22,45.83 v22.25,43.05 | 33.7,45.95 33.87,45.78 v36.47,43.18
  Bottom 1.27: 10.82,19.56 11.07,19.3 | K1.2 K1.P$4
  Bottom 1.778: 6.38,19.3 6.38,19.43 6.5,19.56 K1.P$7 K1.2 K1.P$5 K1.P$4 K1.P$3 K1.P$2 K1.P$1 10.82,19.56 13.49,19.56 14,19.05 10.41,19.05
  Bottom 2.54: 10.44,19.3 11.07,19.3 15.27,19.3 22.76,26.8 J15.1 22.76,32.51 11.33,32.51 4.98,26.04 4.98,20.7 6.38,19.3 9.93,19.3
VIN
  Top 0.406: C9.+ 3.52,41.15 3.52,47.05 | C10.+ 3.49,32.51 3.49,30.77
  Top 1.27: 16.41,17.53 16.41,19.3 17.17,20.07 17.17,26.42 | 16.41,17.53 16.41,16 17.04,15.37 36.47,15.37 J10-1.1 | C1.2 16.41,17.53
  Top 1.778: 17.17,26.42 14.76,26.42 | 14.76,26.42 14.25,26.42 | 14.25,26.42 13.36,26.42 12.85,26.92 7.33,26.92 5.8,28.45 | 14.63,26.29 14.76,26.42 | D1.- 14.38,26.29 14.25,26.42
  Top 2.286: C11.+ C9.+ C10.+ 3.33,30.93 3.49,30.77 5.8,28.45
  Bottom 0.406: J10.1
  Bottom 1.27: J10.1 45.75,5.46 44.09,7.11 42.82,7.11 36.47,13.46 J10-1.1

### Text on the board
tPlace: D11 | V-M | SCL | D3 | V-M | SCL | D12 | GND | SCL | D8 | GND | SCL | D10 | GND | SDA | D9 | GND | SDA | D13 | VCC | SDA | D2 | VCC | SDA | FORWARD | FORWARD | M2- | M2+ | GND | V-M | GND | V-M | OFF | M1- | M1+ | ON | SDA | VCC | A0 | SDA | VCC | A1 | SDA | VCC | A3 | SDA | VCC | NC | SCL | GND | NC | SCL | GND | NC | SCL | GND | A2 | SCL | GND | NC
bPlace: 1 | 2 | 3 | 4 | GND | 12 | ~10 | 8 | ~6 | 4 | 2 | RX<0 | AREF | 13 | ~11 | ~9 | 7 | ~5 | ~3 | TX>1 | www.makeblock.cc | Me-Base Shield v2.0 | IOREF | 3.3V | GND | Vin | A0 | A1 | A2 | A3 | A4 | A5 | RESET | 5V | GND | 8 | 7 | 6 | 5 | 20130601 | SKU:MB02002